# EAGLE design uc_board2 (EAGLE 6.4)
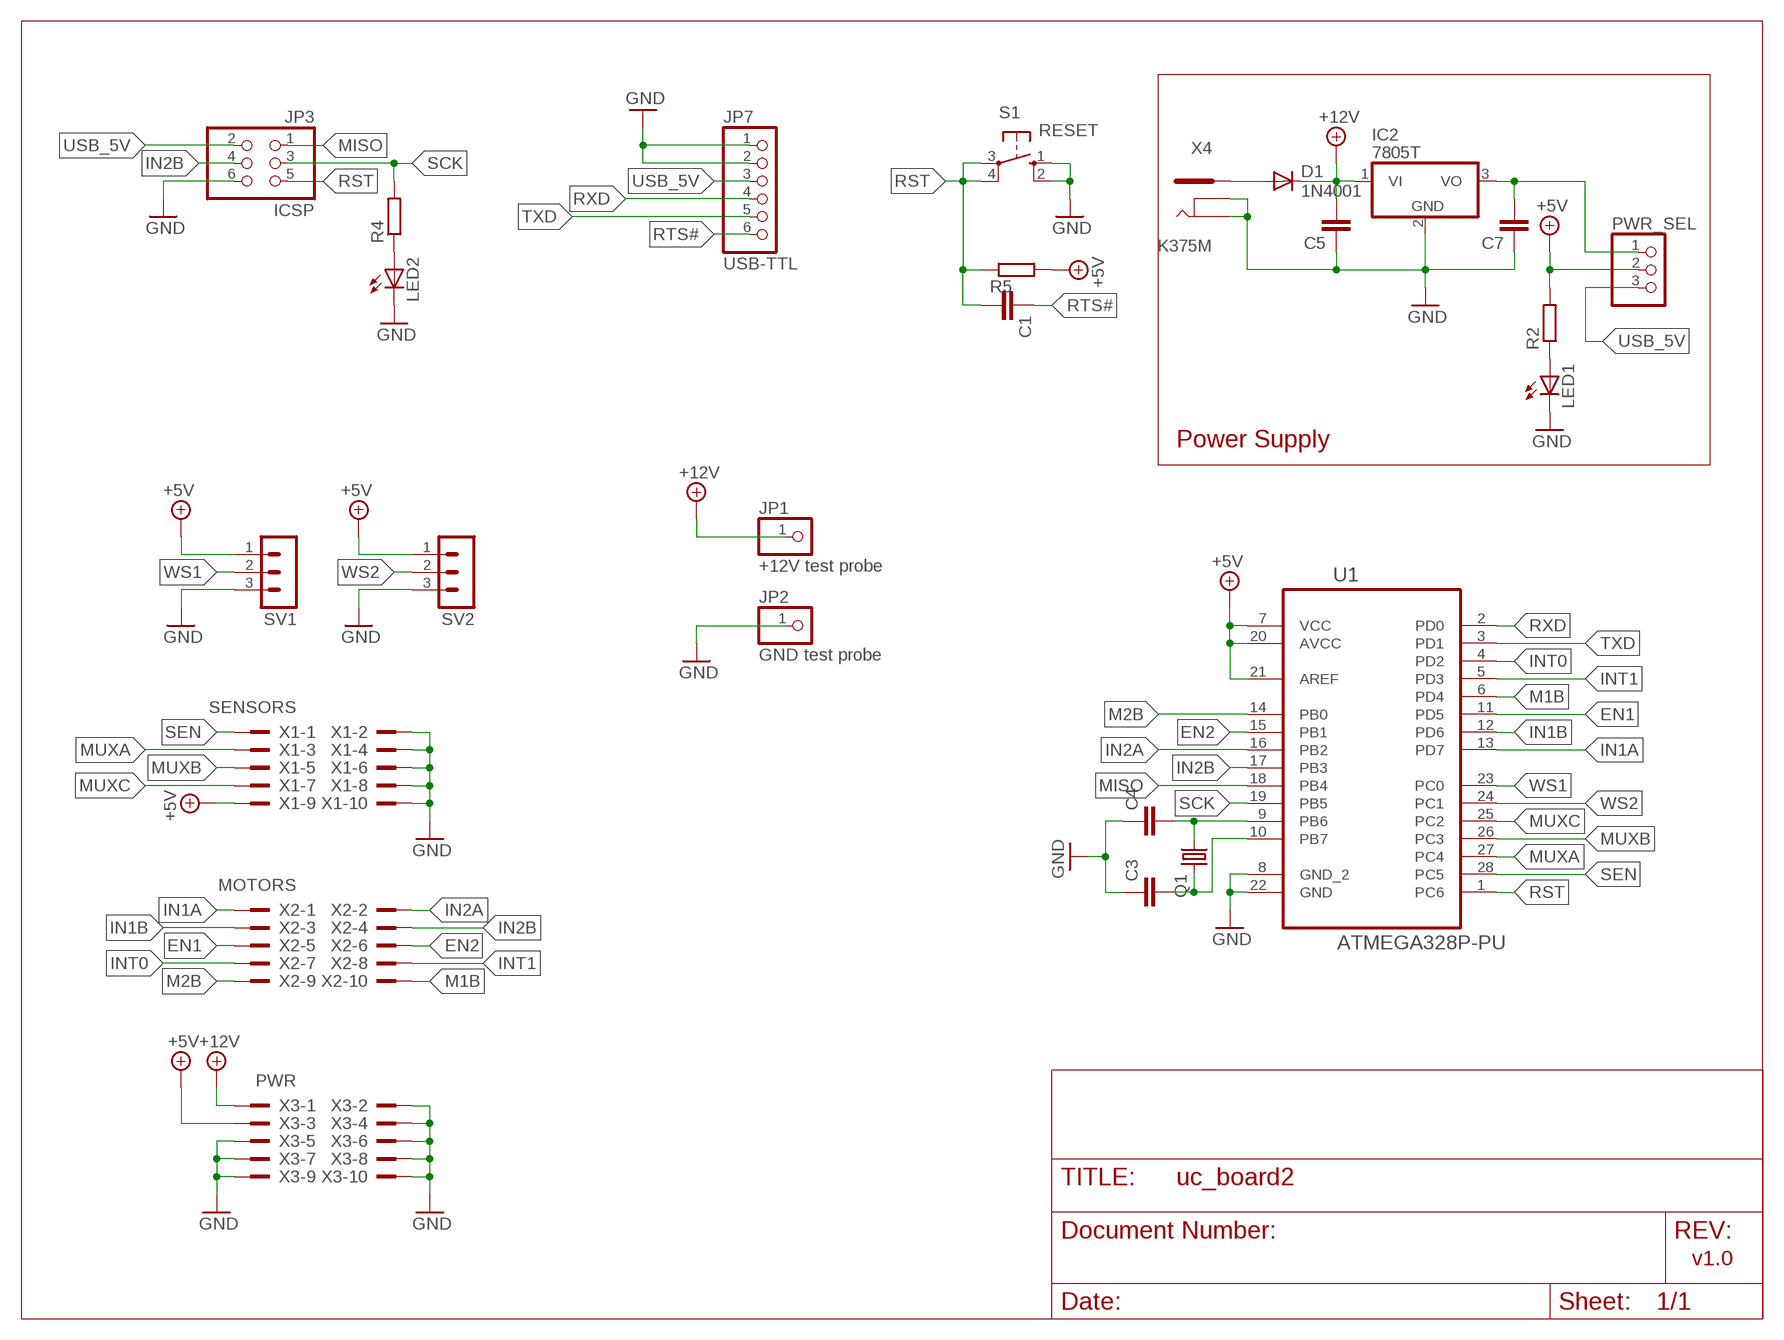
[diagram p0: schematic, sheet 1]

## Parts
C1  C-EU050-025X075  [C050-025X075]
C3  C-EU025-024X044  [C025-024X044]
C4  C-EU025-024X044  [C025-024X044]
C5  C-EU025-050X050  [C025-050X050]
C7  C-EU025-050X050  [C025-050X050]
D1  1N4001  1N4004  [DO41-10]
IC2  7805T  [TO220H]
JP1  +12V test probe  PINHD-1X1  [1X01]
JP2  GND test probe  PINHD-1X1  [1X01]
JP3  ICSP  PINHD-2X3  [2X03]
JP7  USB-TTL  PINHD-1X6/90  [1X06/90]
LED1  LED5MM  [LED5MM]
LED2  LED5MM  [LED5MM]
PWR_SEL  PINHD-1X3  [1X03]
Q1  CRYSTALHC49S  [HC49/S]
R2  R-EU_0204/7  [0204/7]
R4  R-EU_0204/7  [0204/7]
R5  R-EU_0204/7  [0204/7]
S1  RESET  10-XX  [B3F-10XX]
SV1  MA03-1  [MA03-1]
SV2  MA03-1  [MA03-1]
U1  ATMEGA328P-PU  [DIP254P762X457-28]
X1  SENSORS  2510-  [PAK100/2500-10]
X2  MOTORS  2510-  [PAK100/2500-10]
X3  PWR  2510-  [PAK100/2500-10]
X4  K375M  [K375M]

## Nets
+5V: PWR_SEL.2 R2.2 R5.2 SV1.1 SV2.1 U1.7(VCC) U1.20(AVCC) U1.21(AREF) X1.9 X3.3
+12V: C5.2 D1.C IC2.1(VI) JP1.1 X3.1
EN1: U1.11(PD5) X2.5
EN2: U1.15(PB1) X2.6
GND: C3.1 C4.1 C5.1 C7.1 IC2.2(GND) JP2.1 JP3.6 JP7.1 JP7.2 LED1.K(C) LED2.K(C) S1.1(S) S1.2(S1) SV1.3 SV2.3 U1.8(GND_2) U1.22(GND) X1.2 X1.4 X1.6 X1.8 X1.10 X3.2 X3.4 X3.5 X3.6 X3.7 X3.8 X3.9 X3.10 X4.2 X4.3
IN1A: U1.13(PD7) X2.1
IN1B: U1.12(PD6) X2.3
IN2A: U1.16(PB2) X2.2
IN2B: JP3.4 U1.17(PB3) X2.4
INT0: U1.4(PD2) X2.7
INT1: U1.5(PD3) X2.8
M1B: U1.6(PD4) X2.10
M2B: U1.14(PB0) X2.9
MISO: JP3.1 U1.18(PB4)
MUXA: U1.27(PC4) X1.3
MUXB: U1.26(PC3) X1.5
MUXC: U1.25(PC2) X1.7
N$1: C4.2 Q1.1 U1.9(PB6)
N$2: C3.2 Q1.2 U1.10(PB7)
N$3: LED1.A R2.1
N$4: LED2.A R4.1
N$17: D1.A X4.1
N$22: C7.2 IC2.3(VO) PWR_SEL.1
RST: C1.2 JP3.5 R5.1 S1.3(P) S1.4(P1) U1.1(PC6)
RTS#: C1.1 JP7.6
RXD: JP7.4 U1.2(PD0)
SCK: JP3.3 R4.2 U1.19(PB5)
SEN: U1.28(PC5) X1.1
TXD: JP7.5 U1.3(PD1)
USB_5V: JP3.2 JP7.3 PWR_SEL.3
WS1: SV1.2 U1.23(PC0)
WS2: SV2.2 U1.24(PC1)

## Notes on the sheet
- Power Supply
- v1.0

## Library data of the parts
C1 C3-C5 C7 = rcl:C-EU: CAPACITOR, European symbol
D1 = minimidi:1N4004: DIODE general purpose rectifier, 1 A
IC2 = linear:78*: Positive VOLTAGE REGULATOR Source: http://cache.national.com/ds/LM/LM78L05.pdf http://www.fairchildsemi.com/ds/LM/LM7805.pdf
JP1 JP2 = pinhead:PINHD-1X1: PIN HEADER
JP3 = pinhead-ez:PINHD-2X3: PIN HEADER
JP7 = pinhead:PINHD-1X6: PIN HEADER
LED1 LED2 = led:LED: LED OSRAM: - CHIPLED LG R971, LG N971, LY N971, LG Q971, LY Q971, LO R971, LY R971 LH N974, LH R974 LS Q976, LO Q976, LY Q976 LO Q996 - Hyper CHIPLED LW Q18S LB Q993, LB Q99A, LB R99A - SideLED LS A670, LO A670, LY A670, LG A670, LP A670 LB A673, LV A673, LT A673, LW A673 LH A674 LY A675 LS A676, LA A676, LO A676, LY A676, LW A676 LS A679, LY A679, LG A679 - Hyper Micro SIDELED® LS Y876, LA Y876, LO Y876, LY Y876 LT Y87S - SmartLED LW L88C, LW L88S LB L89C, LB L89S, LG L890 LS L89K, LO L89K, LY L89K LS L896, LA L896, LO L896, LY L896 - TOPLED LS T670, LO T670, LY T670, LG T670, LP T670 LSG T670, LSP T670, LSY T670, LOP T670, LYG T670 LG T671, LOG T671, LSG T671 LB T673, LV T673, LT T673, LW T673 LH T674 LS T676, LA T676, LO T676, LY T676, LB T676, LH T676, LSB T676, LW T676 LB T67C, LV T67C, LT T67C, LS T67K, LO T67K, LY T67K, LW E67C LS E67B, LA E67B, LO E67B, LY E67B, LB E67C, LV E67C, LT E67C LW T67C LS T679, LY T679, LG T679 LS T770, LO T770, LY T770, LG T770, LP T770 LB T773, LV T773, LT T773, LW T773 LH T774 LS E675, LA E675, LY E675, LS T675 LS T776, LA T776, LO T776, LY T776, LB T776 LHGB T686 LT T68C, LB T68C - Hyper Mini TOPLED® LB M676 - Mini TOPLED Santana® LG M470 LS M47K, LO M47K, LY M47K Source: http://www.osram.convergy.de LUXEON: - LUMILED® LXK2-PW12-R00, LXK2-PW12-S00, LXK2-PW14-U00, LXK2-PW14-V00 LXK2-PM12-R00, LXK2-PM12-S00, LXK2-PM14-U00 LXK2-PE12-Q00, LXK2-PE12-R00, LXK2-PE12-S00, LXK2-PE14-T00, LXK2-PE14-U00 LXK2-PB12-K00, LXK2-PB12-L00, LXK2-PB12-M00, LXK2-PB14-N00, LXK2-PB14-P00, LXK2-PB14-Q00 LXK2-PR12-L00, LXK2-PR12-M00, LXK2-PR14-Q00, LXK2-PR14-R00 LXK2-PD12-Q00, LXK2-PD12-R00, LXK2-PD12-S00 LXK2-PH12-R00, LXK2-PH12-S00 LXK2-PL12-P00, LXK2-PL12-Q00, LXK2-PL12-R00 Source: www.luxeon.com KINGBRIGHT: KA-3528ASYC Source: www.kingbright.com
PWR_SEL = pinhead:PINHD-1X3: PIN HEADER
Q1 = crystal:CRYSTAL: CRYSTAL; OC_FARNELL: 1667008; OC_NEWARK: unknown
R2 R4 R5 = resistor:R-EU_: RESISTOR, European symbol
S1 = switch-omron:10-XX: OMRON SWITCH; MPN: B3F-1000; OC_FARNELL: 176432; OC_NEWARK: 36M3542
SV1 SV2 = con-lstb:MA03-1: PIN HEADER; OC_FARNELL: unknown; OC_NEWARK: unknown
U1 = atmel2:ATMEGA328P-PU: 8-bit Microcontroller with In-System Programmable Flash; MPN: ATMEGA328P-PU; OC_FARNELL: 1715487; OC_NEWARK: 15R0268; PACKAGE: PDIP-28; SUPPLIER: Atmel
X1-X3 = con-3m:2510-: 3M (TM) Pak 100 4-Wall Header Source: 3M; MF: 3M; MPN: 2510-6002UB; OC_FARNELL: 9838244; OC_NEWARK: 46F4725
X4 = con-shallin:K375M: K375M - DC POWER JACK 2.5mm/CENTRAL PIN Source: Data sheet <http://www.shallin.com/productview.aspx?itemnumber=K375M>

## Board
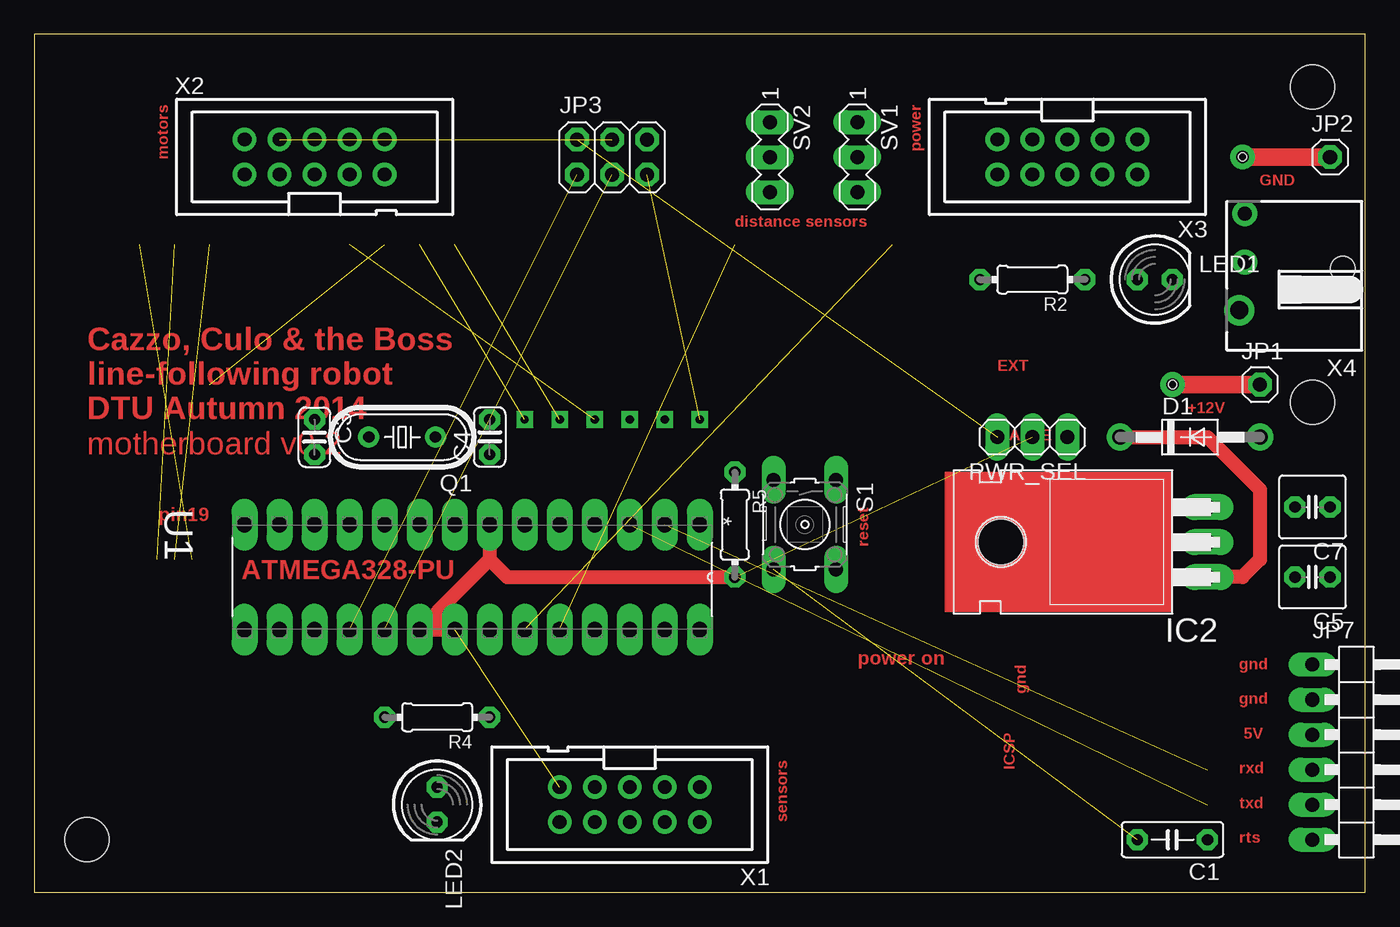
[diagram p1: board, top side]
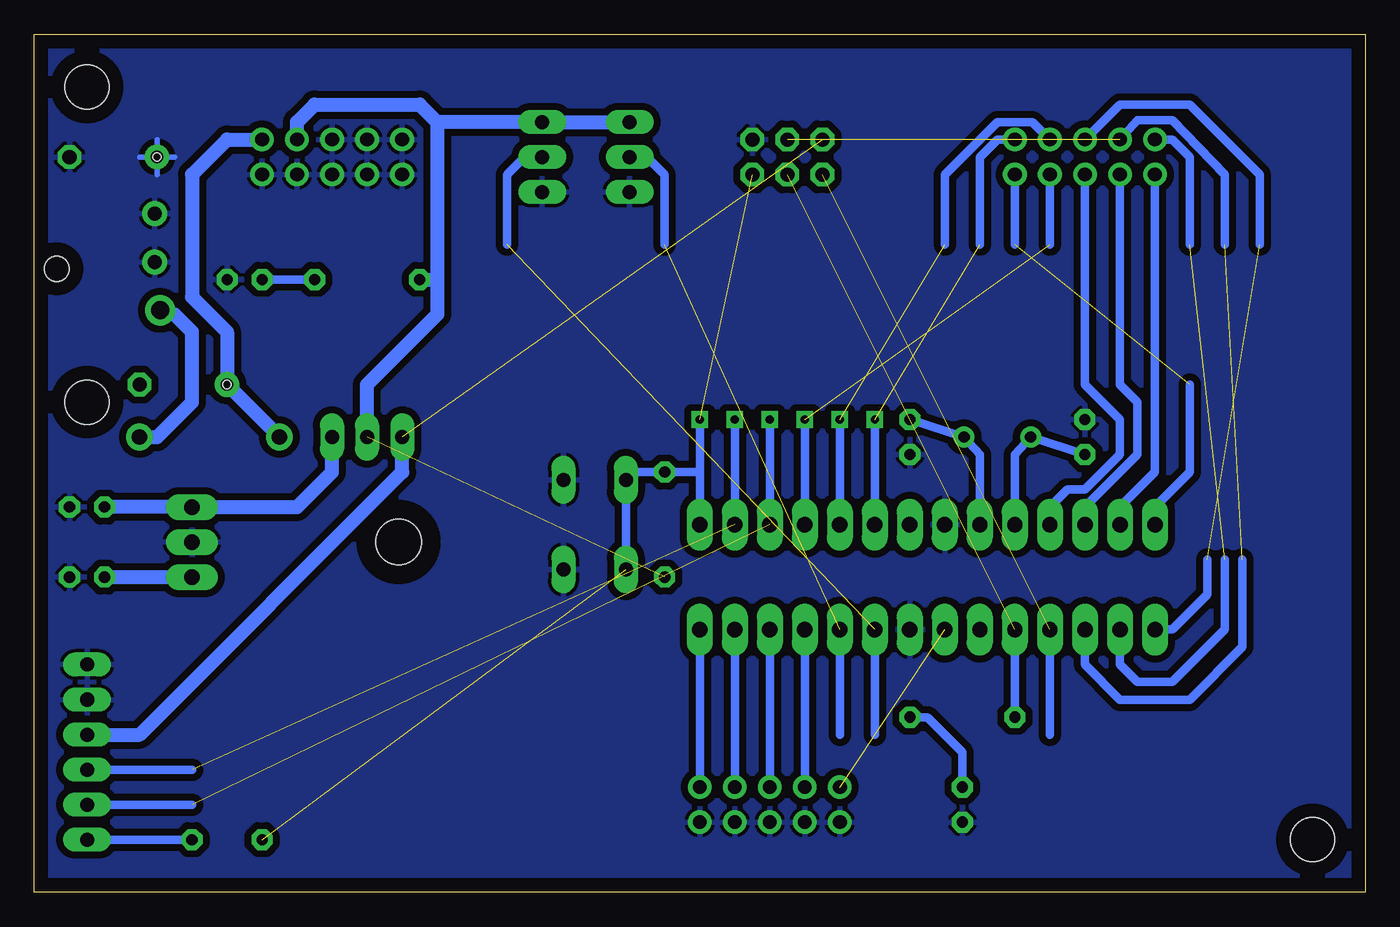
[diagram p2: board, bottom side, seen from below]

Size 96.52 x 62.23 mm. Coordinates in mm from the lower left corner, seen from the top.
Outline: 0,0 96.52,0 96.52,62.23 0,62.23 0,0
Copper layers (1*16): Top 0.035mm / dielectric 1.5mm / Bottom 0.035mm
Design rules "default *": minimum track width 4mil, minimum drill 20mil, track to track 8mil, track to pad 8mil, pad to pad 8mil, via to via 8mil, smd to smd 8mil, copper to edge 40mil, drill to drill 8mil, minimum pad ring 14mil, minimum via ring 12mil, stop-mask expansion 4mil, vias tented up to drill 0mil, thermal gap 10mil
Holes 3.2 mm at 92.71,58.42 3.81,3.81 92.71,35.56
Holes 0.6 mm at 87.63,53.34 82.55,36.83

### Footprints (pad centres in the part's own frame; a part is rotated, then mirrored left to right if it is on the bottom)
C050-025X075 = drill 0.813 octagon: 1 -2.54,0; 2 2.54,0
C025-024X044 = drill 0.813 octagon: 1 -1.27,0; 2 1.27,0
C025-050X050 = drill 0.813 octagon: 1 -1.27,0; 2 1.27,0
DO41-10 = drill 1.118 pad 1.93: A 5.08,0; C -5.08,0
TO220H = drill 1.118 long: 1 -2.54,-10.16; 2 0,-10.16; 3 2.54,-10.16 | hole 3.302: 0,4.826
1X01 = drill 1.016 octagon: 1 0,0
2X03 = drill 1.016 pad 1.676 octagon: 1 -2.54,-1.27; 2 -2.54,1.27; 3 0,-1.27; 4 0,1.27; 5 2.54,-1.27; 6 2.54,1.27
1X06/90 = drill 1.016 long: 1 -6.35,-3.81; 2 -3.81,-3.81; 3 -1.27,-3.81; 4 1.27,-3.81; 5 3.81,-3.81; 6 6.35,-3.81
LED5MM = drill 0.813 octagon: A -1.27,0; K 1.27,0
1X03 = drill 1.016 long: 1 -2.54,0; 2 0,0; 3 2.54,0
HC49/S = drill 0.813: 1 -2.413,0; 2 2.413,0
0204/7 = drill 0.813 octagon: 1 -3.81,0; 2 3.81,0
B3F-10XX = drill 1.016 long: 1 -3.251,2.261; 2 3.251,2.261; 3 -3.251,-2.261; 4 3.251,-2.261
MA03-1 = drill 1.016 long: 1 -2.54,0; 2 0,0; 3 2.54,0
DIP254P762X457-28 = drill 1.118 long: 1 -7.62,33.02; 2 -7.62,30.48; 3 -7.62,27.94; 4 -7.62,25.4; 5 -7.62,22.86; 6 -7.62,20.32; 7 -7.62,17.78; 8 -7.62,15.24; 9 -7.62,12.7; 10 -7.62,10.16; 11 -7.62,7.62; 12 -7.62,5.08; 13 -7.62,2.54; 14 -7.62,0; 15 0,0; 16 0,2.54; 17 0,5.08; 18 0,7.62; 19 0,10.16; 20 0,12.7; 21 0,15.24; 22 0,17.78; 23 0,20.32; 24 0,22.86; 25 0,25.4; 26 0,27.94; 27 0,30.48; 28 0,33.02
PAK100/2500-10 = drill 1 pad 1.422: 1 -5.08,-1.27; 2 -5.08,1.27; 3 -2.54,-1.27; 4 -2.54,1.27; 5 0,-1.27; 6 0,1.27; 7 2.54,-1.27; 8 2.54,1.27; 9 5.08,-1.27; 10 5.08,1.27
K375M = drill 1.3 pad 2.184: 1 -3.5,1.5 | drill 1 pad 1.8: 2 3.5,1.1; 3 0,1.1 | hole 1.8: -0.5,-6

### Placement (x,y rotation side)
C1  82.55,3.81 180 top
C3  20.32,33.02 270 top
C4  33.02,33.02 90 top
C5  92.71,22.86 180 top
C7  92.71,27.94 180 top
D1  83.82,33.02 0 top
IC2  74.93,25.4 90 top
JP1  88.9,36.83 0 top
JP2  93.98,53.34 0 top
JP3  41.91,53.34 0 top
JP7  96.52,10.16 270 top
LED1  81.28,44.45 0 top
LED2  29.21,6.35 270 top
PWR_SEL  72.39,33.02 180 top
Q1  26.67,33.02 180 top
R2  72.39,44.45 180 top
R4  29.21,12.7 180 top
R5  50.8,26.67 270 top
S1  55.88,26.67 270 top
SV1  59.69,53.34 270 top
SV2  53.34,53.34 270 top
U1  15.24,19.05 270 top
X1  43.18,6.35 180 top
X2  20.32,53.34 0 top
X3  74.93,53.34 180 top
X4  88.9,45.72 90 top

### Tracks (layer width: path | path; a pad name or v marks a point on that pad's centre or on a via)
+5V  (2 unrouted)
  Top 1.016: 33.02,24.13 29.21,20.32 29.21,19.05 | U1.20 29.21,19.05 | 29.21,19.05 U1.21 | U1.7 33.02,24.13 | 33.02,24.13 34.29,22.86 R5.2
  Bottom 1.016: X3.3 77.47,55.88 76.2,57.15 68.58,57.15 67.31,55.88 | 67.31,55.88 67.31,44.45 | 67.31,44.45 67.31,41.91 72.39,36.83 PWR_SEL.2 | SV2.1 SV1.1 67.31,55.88 | R2.2 67.31,44.45
  cutout Top (isolate 0.813): 0,62.23 96.52,62.23 96.52,0 0,0
+12V  (via drill 0.9 pad 1.78)
  Top 1.016: D1.C 85.09,33.02 88.9,29.21 88.9,24.13 87.63,22.86 IC2.1
  Top 1.27: JP1.1 v82.55,36.83
  Bottom 1.016: D1.C v82.55,36.83 82.55,40.64 85.09,43.18 85.09,52.07 82.55,54.61 X3.1 | C5.2 IC2.1
EN1
  Bottom 0.61: U1.11 22.86,27.94 21.59,29.21 20.32,29.21 17.78,31.75 17.78,34.29 20.32,36.83 X2.5
EN2  (1 unrouted)
  Bottom 0.61: X2.6 17.78,57.15 12.7,57.15 7.62,52.07 7.62,46.99 | U1.15 13.97,19.05 11.43,21.59 11.43,24.13
GND  (via drill 0.9 pad 1.78)
  Top 1.27: JP2.1 v87.63,53.34
  Bottom 0.406: v87.63,53.34 87.63,54.61 | v87.63,53.34 87.63,52.07 | v87.63,53.34 88.9,53.34 | 86.36,53.34 v87.63,53.34
  pour Bottom (isolate 0.508): 0,62.23 96.52,62.23 96.52,0 0,0
IN1A
  Bottom 0.61: U1.13 17.78,27.94 15.24,30.48 X2.1
IN1B
  Bottom 0.61: U1.12 20.32,27.94 16.51,31.75 16.51,35.56 17.78,36.83 X2.3
IN2A  (1 unrouted)
  Bottom 0.61: X2.2 13.97,54.61 12.7,53.34 12.7,46.99 | U1.16 17.78,16.51 16.51,15.24 13.97,15.24 10.16,19.05 10.16,24.13
IN2B  (2 unrouted)
  Bottom 0.61: X2.4 16.51,56.01 13.97,56.01 10.16,52.07 10.16,46.99 | U1.17 20.32,16.51 17.78,13.97 12.7,13.97 8.89,17.78 8.89,24.13
INT0  (via drill 0.6)  (1 unrouted)
  Bottom 0.61: U1.4 v40.64,34.29 | X2.7 22.86,46.99
INT1  (via drill 0.6)  (1 unrouted)
  Bottom 0.61: X2.8 24.13,55.88 26.67,55.88 30.48,52.07 30.48,46.99 | U1.5 v38.1,34.29
M1B  (via drill 0.6)  (1 unrouted)
  Bottom 0.61: X2.10 26.67,54.61 27.94,53.34 27.94,46.99 | U1.6 v35.56,34.29
M2B  (1 unrouted)
  Bottom 0.61: X2.9 25.4,46.99 | U1.14 15.24,27.94 12.7,30.48 12.7,36.83
MISO  (1 unrouted)
  Bottom 0.61: U1.18 22.86,11.43
MUXA
  Bottom 0.61: X1.3 U1.27
MUXB
  Bottom 0.61: X1.5 U1.26
MUXC
  Bottom 0.61: X1.7 U1.25
N$1
  Bottom 0.61: U1.9 27.94,31.75 Q1.1 C4.2
N$2
  Bottom 0.61: U1.10 25.4,31.75 Q1.2 C3.2
N$3
  Bottom 0.61: R2.1 LED1.A
N$4
  Bottom 0.61: R4.1 31.75,12.7 29.21,10.16 LED2.A
N$17
  Bottom 1.016: D1.A 87.63,33.02 85.09,35.56 85.09,40.64 86.36,41.91 X4.1
N$22
  Bottom 1.016: PWR_SEL.1 74.93,30.48 77.47,27.94 IC2.3 C7.2
RST  (via drill 0.6)  (2 unrouted)
  Bottom 0.61: S1.4 S1.3 53.62,30.48 R5.1 48.26,30.48 | U1.1 48.26,30.48 | 48.26,30.48 v48.26,34.29
RTS#
  Bottom 0.61: JP7.6 C1.1
RXD  (via drill 0.6)  (1 unrouted)
  Bottom 0.61: v45.72,34.29 U1.2 | 85.09,8.89 JP7.4
SCK  (1 unrouted)
  Bottom 0.61: U1.19 R4.2
SEN
  Bottom 0.61: X1.1 U1.28
TXD  (via drill 0.6)  (1 unrouted)
  Bottom 0.61: U1.3 v43.18,34.29 | JP7.5 85.09,6.35
USB_5V  (1 unrouted)
  Bottom 1.016: JP7.3 88.9,11.43 69.85,30.48 PWR_SEL.3
WS1  (1 unrouted)
  Bottom 0.61: SV1.2 60.96,53.34 62.23,52.07 62.23,46.99 | U1.23 35.56,11.43
WS2  (1 unrouted)
  Bottom 0.61: U1.24 38.1,11.43 | SV2.2 52.07,53.34 50.8,52.07 50.8,46.99
(copper drawn outside any net)
  shapes: Top area x1

### Text on the board
Top: motors | power | GND | distance sensors | +12V | Cazzo, Culo & the Boss / line-following robot / DTU Autumn 2014 | EXT / / CABLE | motherboard v0.2 | pin19 | reset | ATMEGA328-PU | power on | gnd | ICSP | sensors | gnd / gnd / 5V / rxd / txd / rts